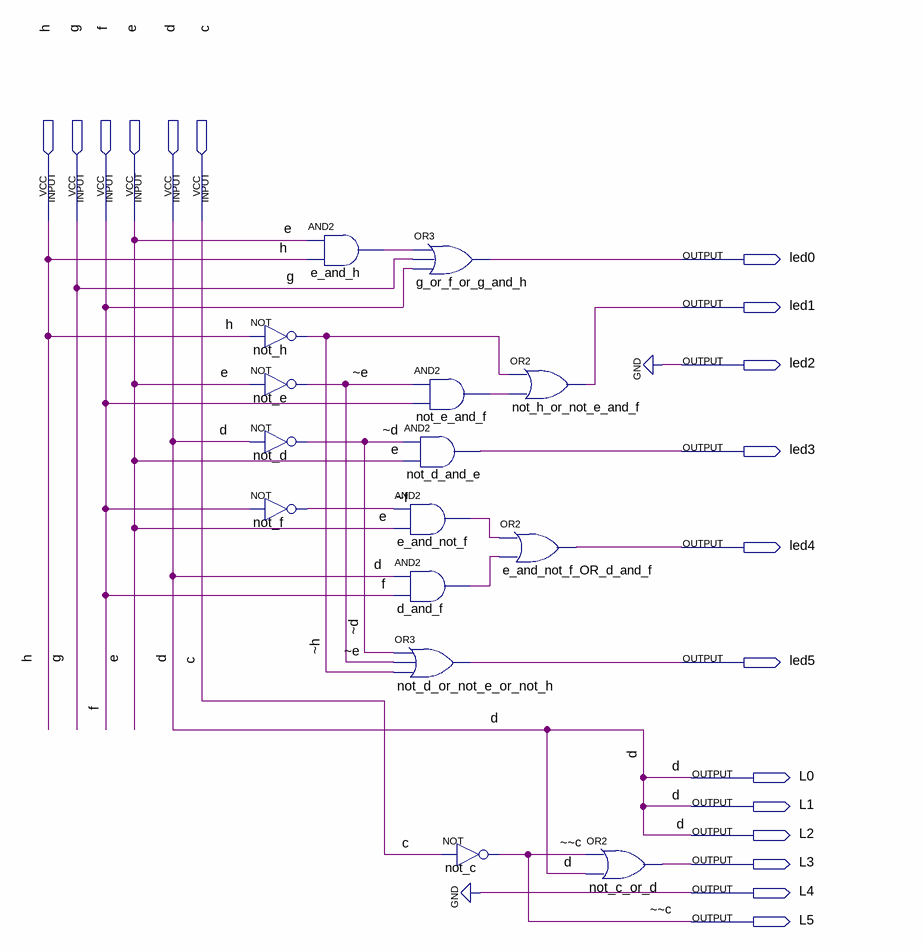
[diagram p0: schematic sheet]
// Quartus schematic av1_esquematico.bdf as structural Verilog: 15 symbols, 18 pins
module av1_esquematico (
  input  h,
  input  g,
  input  f,
  input  e,
  input  d,
  input  c,
  output led0,
  output led1,
  output led2,
  output led3,
  output led4,
  output led5,
  output L0,
  output L1,
  output L2,
  output L3,
  output L4,
  output L5
);

  wire d_and_f_out, e_and_h_out, e_and_not_f_out, not_e_and_f_out, \~d , \~e , \~f , \~h ;

  not not_h (\~h , h);
  not not_e (\~e , e);
  not not_d (\~d , d);
  not not_f (\~f , f);
  and e_and_h (e_and_h_out, e, h);
  or g_or_f_or_g_and_h (led0, e_and_h_out, g, f);
  and not_e_and_f (not_e_and_f_out, \~e , f);
  and not_d_and_e (led3, \~d , e);
  and e_and_not_f (e_and_not_f_out, \~f , e);
  and d_and_f (d_and_f_out, d, f);
  or not_d_or_not_e_or_not_h (led5, \~d , \~e , \~h );
  not not_c (L5, c);
  or not_h_or_not_e_and_f (led1, \~h , not_e_and_f_out);
  or e_and_not_f_OR_d_and_f (led4, e_and_not_f_out, d_and_f_out);
  or not_c_or_d (L3, L5, d);

  assign L0 = d;
  assign L1 = d;
  assign L2 = d;
  assign L4 = 1'b0;
  assign led2 = 1'b0;

  // Other names for the same wires on the sheet: ~~c = L5
endmodule
